# Altium schematic sheet Sheet1.SchDoc
size A4
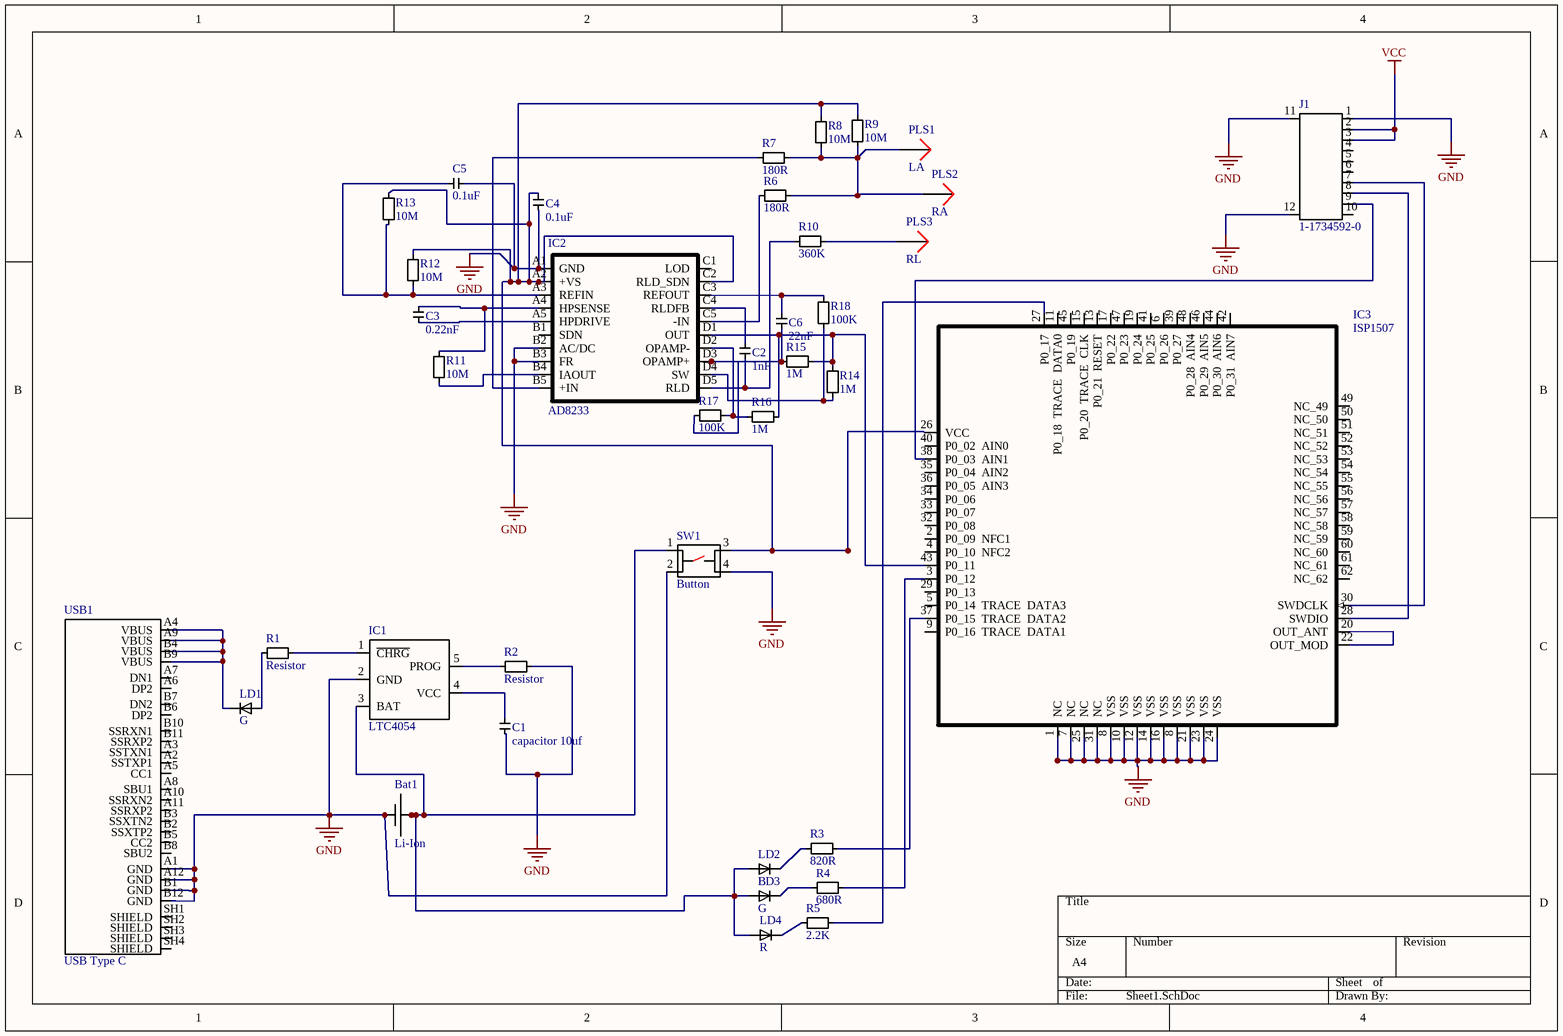
[diagram p0: Sheet1.SchDoc]

## Parts
Bat1  Li-Ion  [LI-ion]
C2  1nF  [Capac]
C3  0.22nF  [Capac]
C4  0.1uF  [Capac]
C5  0.1uF  [Capac]
C6  22nF  [Capac]
IC1  LTC4054  [LTC4054]
IC2  AD8233  [AD8233]
IC3  ISP1507  [ISP1507]
J1  1-1734592-0  [1-1734592-0]
LD1  G  [LED]
LD2  B  [LED]
LD3  G  [LED]
LD4  R  [LED]
PLS1  LA  [output]
PLS2  RA  [output]
PLS3  RL  [output]
R1  Resistor  [Resistor 1]
R2  Resistor  [Resistor 1]
R3  820R  [Resistor 1]
R4  680R  [Resistor 1]
R5  2.2K  [Resistor 1]
R6  180R  [Resistor 1]
R7  180R  [Resistor 1]
R8  10M  [Resistor 1]
R9  10M  [Resistor 1]
R10  360K  [Resistor 1]
R11  10M  [Resistor 1]
R12  10M  [Resistor 1]
R13  10M  [Resistor 1]
R14  1M  [Resistor 1]
R15  1M  [Resistor 1]
R16  1M  [Resistor 1]
R17  100K  [Resistor 1]
R18  100K  [Resistor 1]
SW1  Button  [Button]
USB1  USB Type C  [Type C]
С1  capacitor 10uf  [CAPAC10]

## Nets
GND: Bat1.1 Bat1.2 C4.1 C5.2 IC1.2(GND) IC2.A1(GND) IC2.B2(AC/DC) IC2.B3(FR) IC3.1(NC) IC3.7(NC) IC3.8(VSS) IC3.10(VSS) IC3.12(VSS) IC3.14(VSS) IC3.16(VSS) IC3.21(VSS) IC3.23(VSS) IC3.24(VSS) IC3.25(NC) IC3.31(NC) J1.1 J1.11 J1.12 R2.2 SW1.2 SW1.4 USB1.A1(GND) USB1.A12(GND) USB1.B1(GND) USB1.B12(GND) С1.1
VCC: J1.2 J1.3
NetBat1_3: Bat1.3 Bat1.4 Bat1.5 IC1.3(BAT) LD2.1 LD3.1 LD4.1 SW1.1
NetC2_1: C2.1 IC2.C4(RLDFB)
NetC2_2: C2.2 IC2.D5(RLD) R10.1
NetC3_1: C3.1 IC2.A5(HPDRIVE)
NetC3_2: C3.2 IC2.A4(HPSENSE) R11.2
NetC4_2: C4.2 IC2.A2(+VS) IC2.C2(RLD_SDN) IC3.26(VCC) R8.2 R9.2 R12.2 R13.2 SW1.3
NetC5_1: C5.1 IC2.A3(REFIN) R12.1 R13.1
NetC6_1: C6.1 IC2.D3(OPAMP+) R15.1 R17.1
NetC6_2: C6.2 IC2.C3(REFOUT) R18.2
NetIC1_1: IC1.1(~{CHRG}) R1.2
NetIC1_4: IC1.4(VCC) С1.2
NetIC1_5: IC1.5(PROG) R2.1
NetIC2_B4: IC2.B4(IAOUT) R11.1
NetIC2_B5: IC2.B5(+IN) R7.1
NetIC2_C5: IC2.C5(-IN) R6.1
NetIC2_D1: IC2.D1(OUT) IC3.43(P0_11) R14.2 R15.2 R16.2
NetIC2_D2: IC2.D2(OPAMP-) R16.1 R17.2
NetIC2_D4: IC2.D4(SW) R14.1 R18.1
NetIC3_3: IC3.3(P0_12) R4.2
NetIC3_20: IC3.20(OUT_ANT) IC3.22(OUT_MOD)
NetIC3_27: IC3.27(P0_17) R5.2
NetIC3_28: IC3.28(SWDIO) J1.8
NetIC3_30: IC3.30(SWDCLK) J1.7
NetIC3_37: IC3.37(P0_15__TRACE__DATA2) R3.2
NetIC3_38: IC3.38(P0_03__AIN1) J1.9
NetLD1_1: LD1.1 R1.1
NetLD1_2: LD1.2 USB1.A4(VBUS) USB1.A9(VBUS) USB1.B4(VBUS) USB1.B9(VBUS)
NetLD2_2: LD2.2 R3.1
NetLD3_2: LD3.2 R4.1
NetLD4_2: LD4.2 R5.1
NetPLS1_1: PLS1.1 PLS2.1 R6.2 R7.2 R8.1 R9.1
NetPLS3_1: PLS3.1 R10.2

Not connected (* = marked no-connect by the designer): IC2 B1(SDN) C1(LOD); IC3 2(P0_09__NFC1) 4(P0_10__NFC2) 5(P0_14__TRACE__DATA3) 6(P0_26) 9(P0_16__TRACE__DATA1) 11(P0_18__TRACE__DATA0) 13(P0_21__RESET) 15(P0_20__TRACE__CLK) 17(P0_22) 19(P0_24) 29(P0_13) 32(P0_08) 33(P0_07) 34(P0_06) 35(P0_04__AIN2) 36(P0_05__AIN3) 39(P0_27) 40(P0_02__AIN0) 41(P0_25) 42(P0_31__AIN7) 44(P0_30__AIN6) 45(P0_19) 46(P0_29__AIN5) 47(P0_23) 48(P0_28__AIN4) 49(NC_49) 50(NC_50) 51(NC_51) 52(NC_52) 53(NC_53) 54(NC_54) 55(NC_55) 56(NC_56) 57(NC_57) 58(NC_58) 59(NC_59) 60(NC_60) 61(NC_61) 62(NC_62); J1 4 5 6 10; USB1 A2(SSTXP1) A3(SSTXN1) A5(CC1) A6(DP2) A7(DN1) A8(SBU1) A10(SSRXN2) A11(SSRXP2) B2(SSXTP2) B3(SSXTN2) B5(CC2) B6(DP2) B7(DN2) B8(SBU2) B10(SSRXN1) B11(SSRXP2) SH1(SHIELD) SH2(SHIELD) SH3(SHIELD) SH4(SHIELD)

## Library data of the parts
C2-C6 = capacitor 1uf
LD1-LD4 = led
PLS1-PLS3 = Output
R3-R18 = Resistor